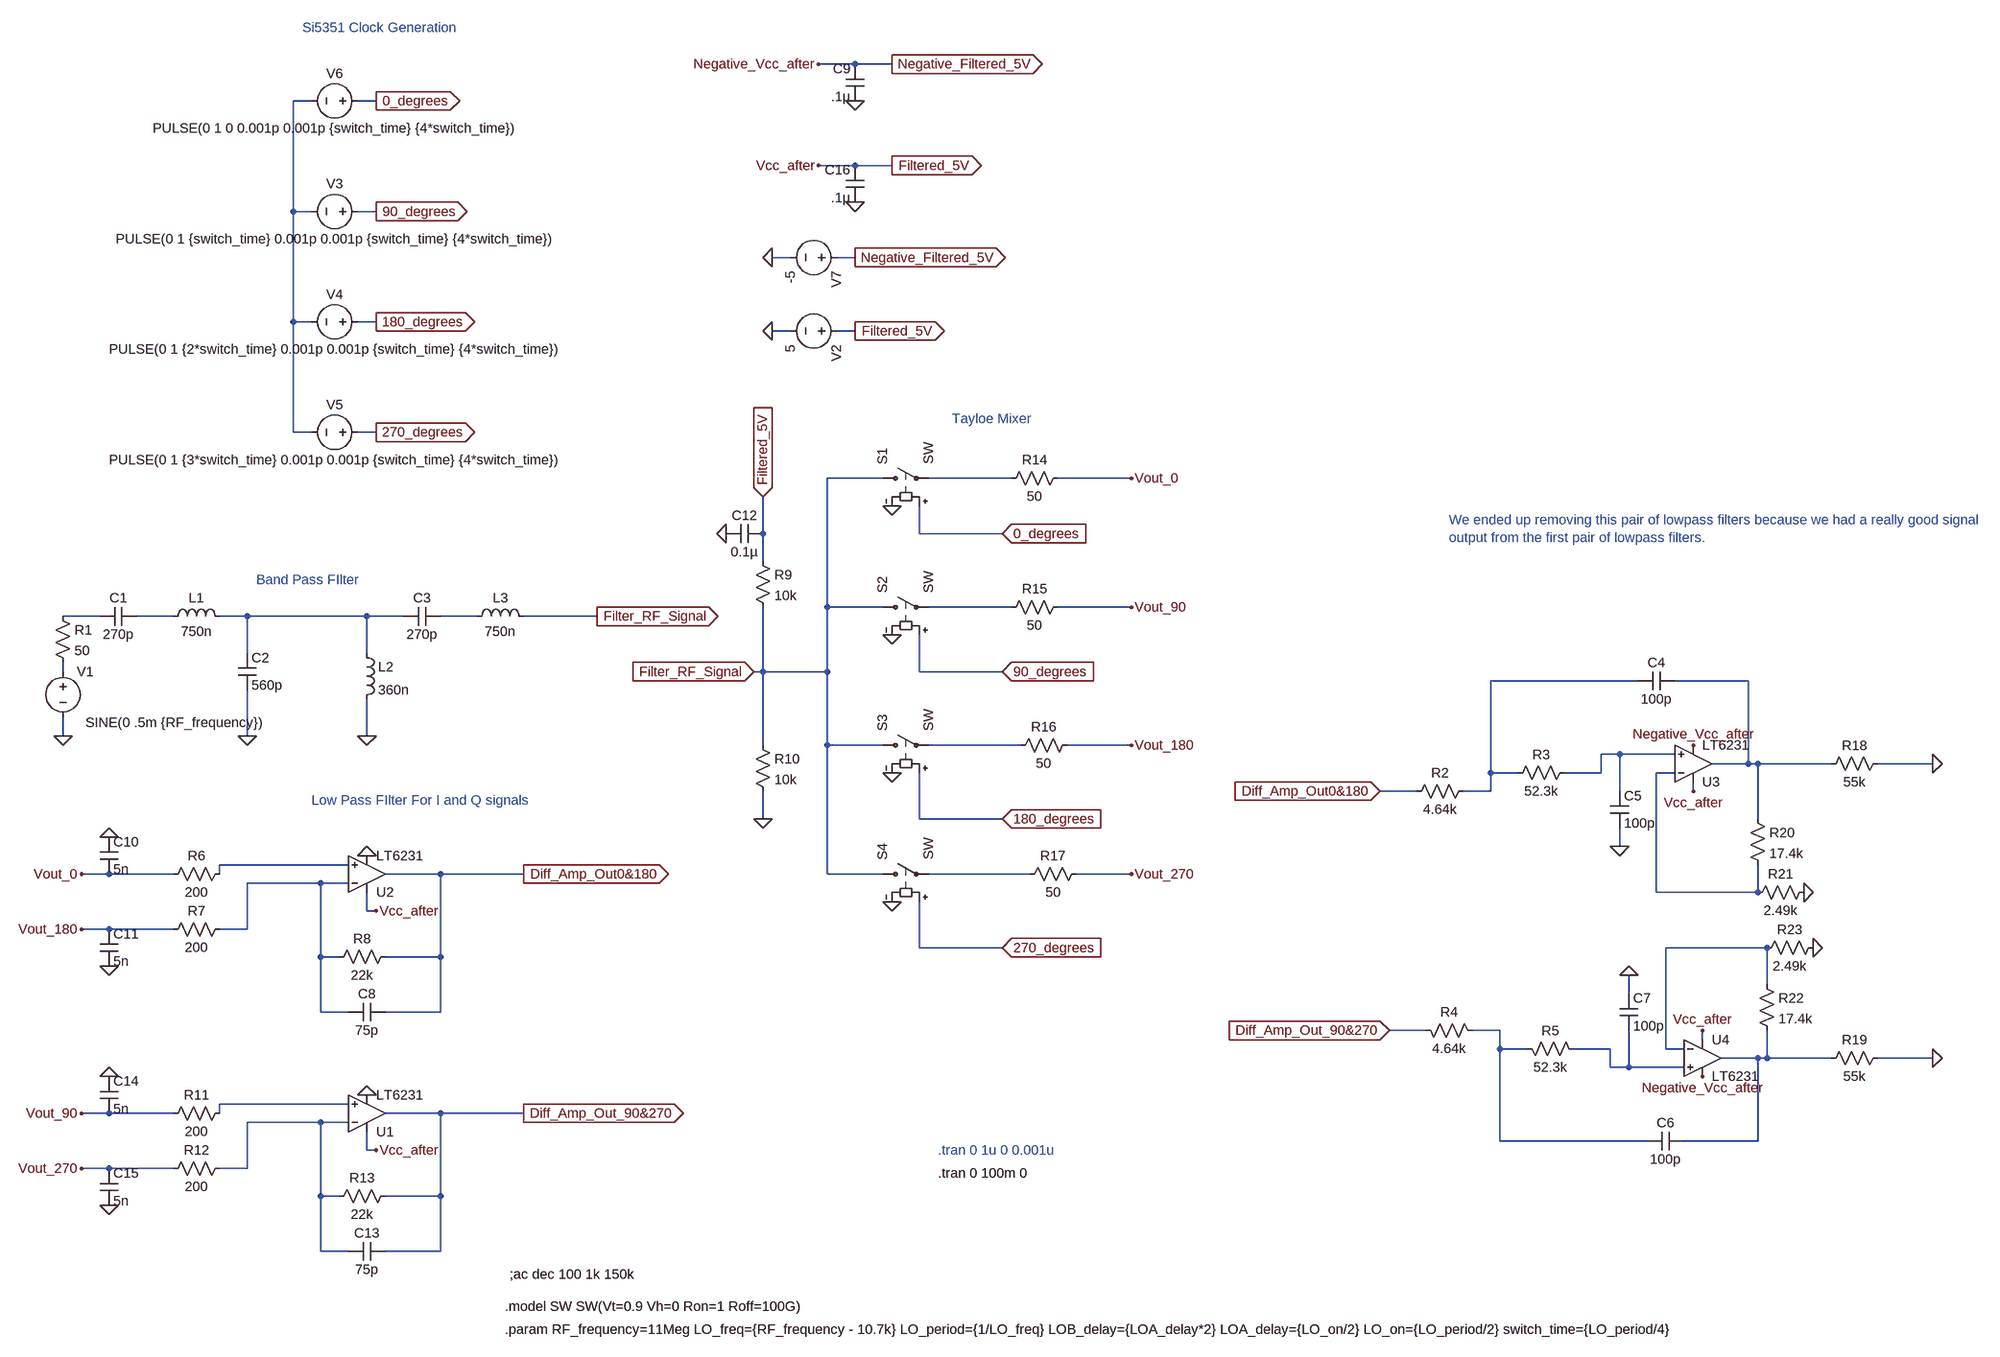
[diagram p0: schematic SDRsim v1.asc]
SDRsim v1.asc, the LTspice schematic file:
Version 4
SHEET 1 3300 2920
WIRE 1264 -1104 1200 -1104
WIRE 1328 -1104 1264 -1104
WIRE 320 -1040 288 -1040
WIRE 432 -1040 400 -1040
WIRE 1264 -928 1200 -928
WIRE 1328 -928 1264 -928
WIRE 288 -848 288 -1040
WIRE 320 -848 288 -848
WIRE 432 -848 400 -848
WIRE 1152 -768 1120 -768
WIRE 1264 -768 1232 -768
WIRE 288 -656 288 -848
WIRE 320 -656 288 -656
WIRE 432 -656 400 -656
WIRE 1152 -640 1120 -640
WIRE 1264 -640 1232 -640
WIRE 288 -464 288 -656
WIRE 320 -464 288 -464
WIRE 432 -464 400 -464
WIRE 1312 -384 1216 -384
WIRE 1536 -384 1392 -384
WIRE 1744 -384 1616 -384
WIRE 1104 -288 1104 -352
WIRE 1376 -288 1376 -336
WIRE 1520 -288 1376 -288
WIRE 1104 -240 1104 -288
WIRE 1216 -160 1216 -384
WIRE 1312 -160 1216 -160
WIRE 1536 -160 1392 -160
WIRE 1744 -160 1616 -160
WIRE -48 -144 -112 -144
WIRE 80 -144 16 -144
WIRE 208 -144 160 -144
WIRE 416 -144 208 -144
WIRE 480 -144 416 -144
WIRE 608 -144 544 -144
WIRE 816 -144 688 -144
WIRE 208 -80 208 -144
WIRE 416 -80 416 -144
WIRE -112 -48 -112 -64
WIRE 1104 -48 1104 -160
WIRE 1104 -48 1088 -48
WIRE 1216 -48 1216 -160
WIRE 1216 -48 1104 -48
WIRE 1376 -48 1376 -112
WIRE 1520 -48 1376 -48
WIRE 2624 -32 2368 -32
WIRE 2816 -32 2688 -32
WIRE -112 64 -112 32
WIRE 208 64 208 -16
WIRE 416 64 416 0
WIRE 1104 80 1104 -48
WIRE 1216 80 1216 -48
WIRE 1312 80 1216 80
WIRE 1552 80 1392 80
WIRE 1744 80 1632 80
WIRE 2592 96 2560 96
WIRE 2688 96 2592 96
WIRE 2816 112 2816 -32
WIRE 2816 112 2752 112
WIRE 2832 112 2816 112
WIRE 2960 112 2832 112
WIRE 3136 112 3040 112
WIRE 2368 128 2368 -32
WIRE 2416 128 2368 128
WIRE 2560 128 2560 96
WIRE 2560 128 2496 128
WIRE 2688 128 2656 128
WIRE 2240 160 2176 160
WIRE 2368 160 2368 128
WIRE 2368 160 2320 160
WIRE 2592 160 2592 96
WIRE 2720 160 2720 144
WIRE 1104 208 1104 160
WIRE 1376 208 1376 128
WIRE 1520 208 1376 208
WIRE 2832 208 2832 112
WIRE 2592 256 2592 224
WIRE 384 288 160 288
WIRE -32 304 -80 304
WIRE 80 304 -32 304
WIRE 160 304 160 288
WIRE 544 304 448 304
WIRE 688 304 544 304
WIRE 1216 304 1216 80
WIRE 1312 304 1216 304
WIRE 1568 304 1392 304
WIRE 1744 304 1648 304
WIRE 336 320 208 320
WIRE 384 320 336 320
WIRE 2656 336 2656 128
WIRE 2832 336 2832 288
WIRE 2832 336 2656 336
WIRE 416 368 416 336
WIRE 432 368 416 368
WIRE -32 400 -80 400
WIRE 80 400 -32 400
WIRE 208 400 208 320
WIRE 208 400 160 400
WIRE 1376 432 1376 352
WIRE 1520 432 1376 432
WIRE 2848 432 2672 432
WIRE 336 448 336 320
WIRE 368 448 336 448
WIRE 544 448 544 304
WIRE 544 448 448 448
WIRE 2848 496 2848 432
WIRE 2608 512 2608 480
WIRE 336 544 336 448
WIRE 384 544 336 544
WIRE 544 544 544 448
WIRE 544 544 448 544
WIRE 2256 576 2192 576
WIRE 2384 576 2336 576
WIRE 2736 592 2736 576
WIRE 2384 608 2384 576
WIRE 2432 608 2384 608
WIRE 2576 608 2512 608
WIRE 2672 608 2672 432
WIRE 2704 608 2672 608
WIRE 2832 624 2768 624
WIRE 2848 624 2848 576
WIRE 2848 624 2832 624
WIRE 2960 624 2848 624
WIRE 3136 624 3040 624
WIRE 2576 640 2576 608
WIRE 2608 640 2608 576
WIRE 2608 640 2576 640
WIRE 2704 640 2608 640
WIRE 384 704 160 704
WIRE -32 720 -80 720
WIRE 80 720 -32 720
WIRE 160 720 160 704
WIRE 544 720 448 720
WIRE 688 720 544 720
WIRE 336 736 208 736
WIRE 384 736 336 736
WIRE 2384 768 2384 608
WIRE 2640 768 2384 768
WIRE 2832 768 2832 624
WIRE 2832 768 2704 768
WIRE 416 784 416 752
WIRE 432 784 416 784
WIRE -32 816 -80 816
WIRE 80 816 -32 816
WIRE 208 816 208 736
WIRE 208 816 160 816
WIRE 336 864 336 736
WIRE 368 864 336 864
WIRE 544 864 544 720
WIRE 544 864 448 864
WIRE 336 960 336 864
WIRE 384 960 336 960
WIRE 544 960 544 864
WIRE 544 960 448 960
FLAG -112 64 0
FLAG 208 64 0
FLAG 416 64 0
FLAG 2592 256 0
FLAG 2608 480 0
FLAG 1264 -1040 0
FLAG 416 272 0
FLAG -32 240 0
FLAG -32 464 0
FLAG 816 -144 Filter_RF_Signal
IOPIN 816 -144 Out
FLAG 1328 -336 0
FLAG 1328 -112 0
FLAG 1328 128 0
FLAG 1328 352 0
FLAG 1088 -48 Filter_RF_Signal
IOPIN 1088 -48 In
FLAG 1040 -288 0
FLAG 1104 208 0
FLAG 1120 -640 0
FLAG 1264 -640 Filtered_5V
IOPIN 1264 -640 Out
FLAG 1104 -352 Filtered_5V
IOPIN 1104 -352 In
FLAG 432 -1040 0_degrees
IOPIN 432 -1040 Out
FLAG 432 -848 90_degrees
IOPIN 432 -848 Out
FLAG 432 -656 180_degrees
IOPIN 432 -656 Out
FLAG 432 -464 270_degrees
IOPIN 432 -464 Out
FLAG 1520 -288 0_degrees
IOPIN 1520 -288 In
FLAG 1520 -48 90_degrees
IOPIN 1520 -48 In
FLAG 1520 208 180_degrees
IOPIN 1520 208 In
FLAG 1520 432 270_degrees
IOPIN 1520 432 In
FLAG 1200 -1104 Negative_Vcc_after
FLAG 416 688 0
FLAG -32 656 0
FLAG -32 880 0
FLAG 1744 -384 Vout_0
FLAG -80 304 Vout_0
FLAG 1744 -160 Vout_90
FLAG -80 720 Vout_90
FLAG 1744 80 Vout_180
FLAG -80 400 Vout_180
FLAG 1744 304 Vout_270
FLAG -80 816 Vout_270
FLAG 1328 -1104 Negative_Filtered_5V
IOPIN 1328 -1104 Out
FLAG 432 368 Vcc_after
FLAG 432 784 Vcc_after
FLAG 2720 160 Vcc_after
FLAG 2736 576 Vcc_after
FLAG 688 720 Diff_Amp_Out_90&270
IOPIN 688 720 Out
FLAG 2192 576 Diff_Amp_Out_90&270
IOPIN 2192 576 In
FLAG 688 304 Diff_Amp_Out0&180
IOPIN 688 304 Out
FLAG 2176 160 Diff_Amp_Out0&180
IOPIN 2176 160 In
FLAG 3136 112 0
FLAG 3136 624 0
FLAG 2912 336 0
FLAG 2928 432 0
FLAG 1120 -768 0
FLAG 1264 -768 Negative_Filtered_5V
IOPIN 1264 -768 Out
FLAG 1264 -864 0
FLAG 1200 -928 Vcc_after
FLAG 1328 -928 Filtered_5V
IOPIN 1328 -928 Out
FLAG 2720 80 Negative_Vcc_after
FLAG 2736 656 Negative_Vcc_after
SYMBOL voltage -112 -64 R0
WINDOW 123 40 48 Left 2
WINDOW 39 39 77 Left 2
WINDOW 3 39 105 Left 2
SYMATTR Value SINE(0 .5m {RF_frequency})
SYMATTR InstName V1
SYMBOL cap -48 -128 R270
WINDOW 0 32 32 VTop 2
WINDOW 3 0 32 VBottom 2
SYMATTR InstName C1
SYMATTR Value 270p
SYMBOL ind 64 -128 R270
WINDOW 0 32 56 VTop 2
WINDOW 3 5 56 VBottom 2
SYMATTR InstName L1
SYMATTR Value 750n
SYMBOL cap 192 -80 R0
SYMATTR InstName C2
SYMATTR Value 560p
SYMBOL ind 400 -96 R0
SYMATTR InstName L2
SYMATTR Value 360n
SYMBOL cap 480 -128 R270
WINDOW 0 32 32 VTop 2
WINDOW 3 0 32 VBottom 2
SYMATTR InstName C3
SYMATTR Value 270p
SYMBOL ind 592 -128 R270
WINDOW 0 32 56 VTop 2
WINDOW 3 5 56 VBottom 2
SYMATTR InstName L3
SYMATTR Value 750n
SYMBOL res -128 -160 R0
SYMATTR InstName R1
SYMATTR Value 50
SYMBOL res 2336 144 R90
WINDOW 0 0 56 VBottom 2
WINDOW 3 32 56 VTop 2
SYMATTR InstName R2
SYMATTR Value 4.64k
SYMBOL res 2512 112 R90
WINDOW 0 0 56 VBottom 2
WINDOW 3 32 56 VTop 2
SYMATTR InstName R3
SYMATTR Value 52.3k
SYMBOL cap 2688 -48 R90
WINDOW 0 0 32 VBottom 2
WINDOW 3 32 32 VTop 2
SYMATTR InstName C4
SYMATTR Value 100p
SYMBOL cap 2576 160 R0
SYMATTR InstName C5
SYMATTR Value 100p
SYMBOL res 2352 592 M270
WINDOW 0 32 56 VTop 2
WINDOW 3 0 56 VBottom 2
SYMATTR InstName R4
SYMATTR Value 4.64k
SYMBOL res 2528 624 M270
WINDOW 0 32 56 VTop 2
WINDOW 3 0 56 VBottom 2
SYMATTR InstName R5
SYMATTR Value 52.3k
SYMBOL cap 2704 784 M270
WINDOW 0 32 32 VTop 2
WINDOW 3 0 32 VBottom 2
SYMATTR InstName C6
SYMATTR Value 100p
SYMBOL cap 2592 576 M180
WINDOW 0 24 56 Left 2
WINDOW 3 24 8 Left 2
SYMATTR InstName C7
SYMATTR Value 100p
SYMBOL sw 1296 -384 R270
SYMATTR InstName S1
SYMBOL sw 1296 -160 R270
SYMATTR InstName S2
SYMBOL sw 1296 80 R270
SYMATTR InstName S3
SYMBOL sw 1296 304 R270
SYMATTR InstName S4
SYMBOL res 176 288 R90
WINDOW 0 0 56 VBottom 2
WINDOW 3 32 56 VTop 2
SYMATTR InstName R6
SYMATTR Value 200
SYMBOL res 176 384 R90
WINDOW 0 0 56 VBottom 2
WINDOW 3 32 56 VTop 2
SYMATTR InstName R7
SYMATTR Value 200
SYMBOL res 464 432 R90
WINDOW 0 0 56 VBottom 2
WINDOW 3 32 56 VTop 2
SYMATTR InstName R8
SYMATTR Value 22k
SYMBOL cap 448 528 R90
WINDOW 0 0 32 VBottom 2
WINDOW 3 32 32 VTop 2
SYMATTR InstName C8
SYMATTR Value 75p
SYMBOL cap 1280 -1040 R180
WINDOW 0 24 56 Left 2
WINDOW 3 24 8 Left 2
SYMATTR InstName C9
SYMATTR Value .1µ
SYMBOL cap -48 240 R0
SYMATTR InstName C10
SYMATTR Value 5n
SYMBOL cap -48 400 R0
SYMATTR InstName C11
SYMATTR Value 5n
SYMBOL res 1088 -256 R0
SYMATTR InstName R9
SYMATTR Value 10k
SYMBOL res 1088 64 R0
SYMATTR InstName R10
SYMATTR Value 10k
SYMBOL cap 1104 -304 R90
WINDOW 0 0 32 VBottom 2
WINDOW 3 32 32 VTop 2
SYMATTR InstName C12
SYMATTR Value 0.1µ
SYMBOL voltage 1248 -640 R90
WINDOW 123 0 0 Left 0
WINDOW 39 0 0 Left 0
SYMATTR InstName V2
SYMATTR Value 5
SYMBOL voltage 416 -848 R90
WINDOW 0 -32 56 VBottom 2
WINDOW 3 32 56 VTop 2
WINDOW 123 0 0 Left 0
WINDOW 39 0 0 Left 0
SYMATTR InstName V3
SYMATTR Value PULSE(0 1 {switch_time} 0.001p 0.001p {switch_time} {4*switch_time})
SYMBOL voltage 416 -656 R90
WINDOW 0 -32 56 VBottom 2
WINDOW 3 32 56 VTop 2
WINDOW 123 0 0 Left 0
WINDOW 39 0 0 Left 0
SYMATTR InstName V4
SYMATTR Value PULSE(0 1 {2*switch_time} 0.001p 0.001p {switch_time} {4*switch_time})
SYMBOL voltage 416 -464 R90
WINDOW 0 -32 56 VBottom 2
WINDOW 3 32 56 VTop 2
WINDOW 123 0 0 Left 0
WINDOW 39 0 0 Left 0
SYMATTR InstName V5
SYMATTR Value PULSE(0 1 {3*switch_time} 0.001p 0.001p {switch_time} {4*switch_time})
SYMBOL res 176 704 R90
WINDOW 0 0 56 VBottom 2
WINDOW 3 32 56 VTop 2
SYMATTR InstName R11
SYMATTR Value 200
SYMBOL res 176 800 R90
WINDOW 0 0 56 VBottom 2
WINDOW 3 32 56 VTop 2
SYMATTR InstName R12
SYMATTR Value 200
SYMBOL res 464 848 R90
WINDOW 0 0 56 VBottom 2
WINDOW 3 32 56 VTop 2
SYMATTR InstName R13
SYMATTR Value 22k
SYMBOL cap 448 944 R90
WINDOW 0 0 32 VBottom 2
WINDOW 3 32 32 VTop 2
SYMATTR InstName C13
SYMATTR Value 75p
SYMBOL cap -48 656 R0
SYMATTR InstName C14
SYMATTR Value 5n
SYMBOL cap -48 816 R0
SYMATTR InstName C15
SYMATTR Value 5n
SYMBOL voltage 416 -1040 R90
WINDOW 0 -32 56 VBottom 2
WINDOW 3 32 56 VTop 2
WINDOW 123 0 0 Left 0
WINDOW 39 0 0 Left 0
SYMATTR InstName V6
SYMATTR Value PULSE(0 1 0 0.001p 0.001p {switch_time} {4*switch_time})
SYMBOL OpAmps\\LT6231 416 720 M180
SYMATTR InstName U1
SYMBOL OpAmps\\LT6231 416 304 M180
SYMATTR InstName U2
SYMBOL OpAmps\\LT6231 2720 112 M180
SYMATTR InstName U3
SYMBOL OpAmps\\LT6231 2736 624 R0
SYMATTR InstName U4
SYMBOL res 1632 -400 R90
WINDOW 0 0 56 VBottom 2
WINDOW 3 32 56 VTop 2
SYMATTR InstName R14
SYMATTR Value 50
SYMBOL res 1632 -176 R90
WINDOW 0 0 56 VBottom 2
WINDOW 3 32 56 VTop 2
SYMATTR InstName R15
SYMATTR Value 50
SYMBOL res 1648 64 R90
WINDOW 0 0 56 VBottom 2
WINDOW 3 32 56 VTop 2
SYMATTR InstName R16
SYMATTR Value 50
SYMBOL res 1664 288 R90
WINDOW 0 0 56 VBottom 2
WINDOW 3 32 56 VTop 2
SYMATTR InstName R17
SYMATTR Value 50
SYMBOL res 3056 96 R90
WINDOW 0 0 56 VBottom 2
WINDOW 3 32 56 VTop 2
SYMATTR InstName R18
SYMATTR Value 55k
SYMBOL res 3056 608 R90
WINDOW 0 0 56 VBottom 2
WINDOW 3 32 56 VTop 2
SYMATTR InstName R19
SYMATTR Value 55k
SYMBOL res 2816 192 R0
SYMATTR InstName R20
SYMATTR Value 17.4k
SYMBOL res 2928 320 R90
WINDOW 0 0 56 VBottom 2
WINDOW 3 32 56 VTop 2
SYMATTR InstName R21
SYMATTR Value 2.49k
SYMBOL res 2832 480 R0
SYMATTR InstName R22
SYMATTR Value 17.4k
SYMBOL res 2944 416 R90
WINDOW 0 0 56 VBottom 2
WINDOW 3 32 56 VTop 2
SYMATTR InstName R23
SYMATTR Value 2.49k
SYMBOL voltage 1248 -768 R90
WINDOW 123 0 0 Left 0
WINDOW 39 0 0 Left 0
SYMATTR InstName V7
SYMATTR Value -5
SYMBOL cap 1280 -864 R180
WINDOW 0 24 56 Left 2
WINDOW 3 24 8 Left 2
SYMATTR InstName C16
SYMATTR Value .1µ
TEXT 664 1000 Left 2 !;ac dec 100 1k 150k
TEXT 656 1056 Left 2 !.model SW SW(Vt=0.9 Vh=0 Ron=1 Roff=100G)
TEXT 656 1096 Left 2 !.param RF_frequency=11Meg LO_freq={RF_frequency - 10.7k} LO_period={1/LO_freq} LOB_delay={LOA_delay*2} LOA_delay={LO_on/2} LO_on={LO_period/2} switch_time={LO_period/4}
TEXT 1408 824 Left 2 !.tran 0 100m 0
TEXT 1408 784 Left 2 ;.tran 0 1u 0 0.001u
TEXT 2296 -312 Left 2 ;We ended up removing this pair of lowpass filters because we had a really good signal\noutput from the first pair of lowpass filters.
TEXT 320 176 Left 2 ;Low Pass FIlter For I and Q signals
TEXT 224 -208 Left 2 ;Band Pass FIlter
TEXT 1432 -488 Left 2 ;Tayloe Mixer
TEXT 304 -1168 Left 2 ;Si5351 Clock Generation

The netlist it stands for:
* SDRsim v1.asc
V1 N008 0 SINE(0 .5m {RF_frequency})
C1 N004 N005 270p
L1 N005 N006 750n
C2 N006 0 560p
L2 N006 0 360n
C3 N006 N007 270p
L3 N007 Filter_RF_Signal 750n
R1 N004 N008 50
R2 N009 Diff_Amp_Out0&180 4.64k
R3 N012 N009 52.3k
C4 N010 N009 100p
C5 N012 0 100p
R4 N018 Diff_Amp_Out_90&270 4.64k
R5 N019 N018 52.3k
C6 N020 N018 100p
C7 N019 0 100p
S1 Filter_RF_Signal N002 0_degrees 0 SW
S2 Filter_RF_Signal N003 90_degrees 0 SW
S3 Filter_RF_Signal N011 180_degrees 0 SW
S4 Filter_RF_Signal N015 270_degrees 0 SW
R6 N014 Vout_0 200
R7 N016 Vout_180 200
R8 Diff_Amp_Out0&180 N016 22k
C8 Diff_Amp_Out0&180 N016 75p
C9 0 Negative_Filtered_5V .1µ
C10 0 Vout_0 5n
C11 Vout_180 0 5n
R9 Vcc_after Filter_RF_Signal 10k
R10 Filter_RF_Signal 0 10k
C12 Vcc_after 0 0.1µ
V2 Vcc_after 0 5
V3 90_degrees N001 PULSE(0 1 {switch_time} 0.001p 0.001p {switch_time} {4*switch_time})
V4 180_degrees N001 PULSE(0 1 {2*switch_time} 0.001p 0.001p {switch_time} {4*switch_time})
V5 270_degrees N001 PULSE(0 1 {3*switch_time} 0.001p 0.001p {switch_time} {4*switch_time})
R11 N021 Vout_90 200
R12 N022 Vout_270 200
R13 Diff_Amp_Out_90&270 N022 22k
C13 Diff_Amp_Out_90&270 N022 75p
C14 0 Vout_90 5n
C15 Vout_270 0 5n
V6 0_degrees N001 PULSE(0 1 0 0.001p 0.001p {switch_time} {4*switch_time})
XU1 N021 N022 Diff_Amp_Out_90&270 Vcc_after 0 LT6231  ; pins In+ In- OUT V+ V-
XU2 N014 N016 Diff_Amp_Out0&180 Vcc_after 0 LT6231  ; pins In+ In- OUT V+ V-
XU3 N012 N013 N010 Vcc_after Negative_Filtered_5V LT6231  ; pins In+ In- OUT V+ V-
XU4 N019 N017 N020 Vcc_after Negative_Filtered_5V LT6231  ; pins In+ In- OUT V+ V-
R14 Vout_0 N002 50
R15 Vout_90 N003 50
R16 Vout_180 N011 50
R17 Vout_270 N015 50
R18 0 N010 55k
R19 0 N020 55k
R20 N010 N013 17.4k
R21 0 N013 2.49k
R22 N017 N020 17.4k
R23 0 N017 2.49k
V7 Negative_Filtered_5V 0 -5
C16 0 Vcc_after .1µ
;ac dec 100 1k 150k
.model SW SW(Vt=0.9 Vh=0 Ron=1 Roff=100G)
.param RF_frequency=11Meg LO_freq={RF_frequency - 10.7k} LO_period={1/LO_freq} LOB_delay={LOA_delay*2} LOA_delay={LO_on/2} LO_on={LO_period/2} switch_time={LO_period/4}
.tran 0 100m 0
* .tran 0 1u 0 0.001u
* We ended up removing this pair of lowpass filters because we had a really good signal
* output from the first pair of lowpass filters.
* Low Pass FIlter For I and Q signals
* Band Pass FIlter
* Tayloe Mixer
* Si5351 Clock Generation
.lib LTC2.lib
.backanno
.end